# Altium schematic sheet STM32F103C8.SchDoc
size A4
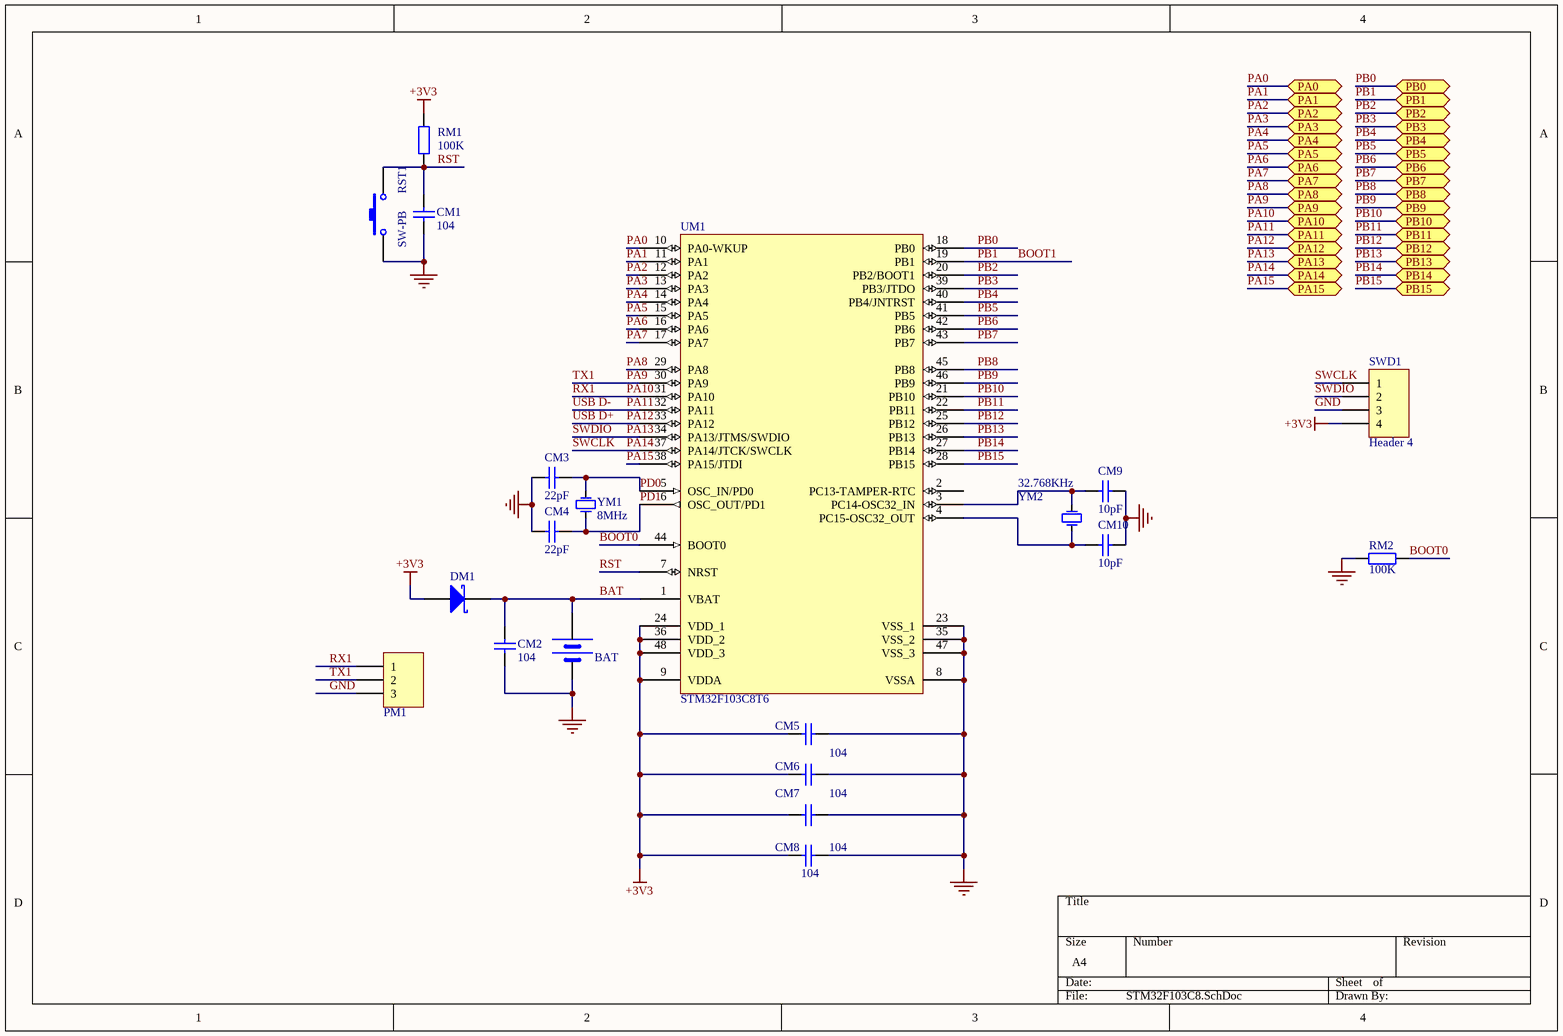
[diagram p0: STM32F103C8.SchDoc]

## Parts
BAT  BATT  [BATM]  (value not drawn)
CM1  value 104  [CAPC1608N]  (hidden comment: Cap1)
CM2  value 104  [CAPC1608N]  (hidden comment: Cap1)
CM3  value 22pF  [CAPC1608N]  (hidden comment: Cap1)
CM4  value 22pF  [CAPC1608N]  (hidden comment: Cap1)
CM5  value 104  [CAPC1608N]  (hidden comment: Cap1)
CM6  value 104  [CAPC1608N]  (hidden comment: Cap1)
CM7  value 104  [CAPC1608N]  (hidden comment: Cap1)
CM8  value 104  [CAPC1608N]  (hidden comment: Cap1)
CM9  value 10pF  [CAPC1608N]  (hidden comment: Cap1)
CM10  value 10pF  [CAPC1608N]  (hidden comment: Cap1)
DM1  D Schottky  [DO-214AC]  (value not drawn)
PM1  Header 3  [HDR1X3]  (value not drawn)
RM1  value 100K  [RESC1608N]  (hidden comment: Res1)
RM2  value 100K  [RESC1608N]  (hidden comment: Res1)
RST1  SW-PB  [SW-3x6]
SWD1  Header 4  [HDR1X4]
UM1  STM32F103C8T6  [LQFP48_L]
YM1  8MHz  [XTAL-5032]
YM2  32.768KHz  [XTAL-206 - duplicate]

## Ports
PA0, PA1, PA2, PA3, PA4, PA5, PA6, PA7, PA8, PA9, PA10, PA11, PA12, PA13, PA14, PA15, PB0, PB1, PB2, PB3, PB4, PB5, PB6, PB7, PB8, PB9, PB10, PB11, PB12, PB13, PB14, PB15

## Nets
+3V3: CM5.2 CM6.2 CM7.2 CM8.2 DM1.1(A) RM1.2 SWD1.4 UM1.9(VDDA) UM1.24(VDD_1) UM1.36(VDD_2) UM1.48(VDD_3)
GND: BAT.2(GND) CM1.1 CM2.1 CM3.1 CM4.1 CM5.1 CM6.1 CM7.1 CM8.1 CM9.1 CM10.1 PM1.3 RM2.2 RST1.1 SWD1.3 UM1.8(VSSA) UM1.23(VSS_1) UM1.35(VSS_2) UM1.47(VSS_3)
BAT: BAT.1(VCC) CM2.2 DM1.2(K) UM1.1(VBAT)
BOOT0: RM2.1 UM1.44(BOOT0)
BOOT1: UM1.19(PB1) ; port PB1  [also labelled PB1]
PA0: UM1.10(PA0-WKUP) ; port PA0
PA1: UM1.11(PA1) ; port PA1
PA2: UM1.12(PA2) ; port PA2
PA3: UM1.13(PA3) ; port PA3
PA4: UM1.14(PA4) ; port PA4
PA5: UM1.15(PA5) ; port PA5
PA6: UM1.16(PA6) ; port PA6
PA7: UM1.17(PA7) ; port PA7
PA8: UM1.29(PA8) ; port PA8
PA9: PM1.2 UM1.30(PA9) ; port PA9  [also labelled TX1]
PA10: PM1.1 UM1.31(PA10) ; port PA10  [also labelled RX1]
PA11: UM1.32(PA11) ; port PA11  [also labelled USB D-]
PA12: UM1.33(PA12) ; port PA12  [also labelled USB D+]
PA13: SWD1.2 UM1.34(PA13/JTMS/SWDIO) ; port PA13  [also labelled SWDIO]
PA14: SWD1.1 UM1.37(PA14/JTCK/SWCLK) ; port PA14  [also labelled SWCLK]
PA15: UM1.38(PA15/JTDI) ; port PA15
PB0: UM1.18(PB0) ; port PB0
PB2: UM1.20(PB2/BOOT1) ; port PB2
PB3: UM1.39(PB3/JTDO) ; port PB3
PB4: UM1.40(PB4/JNTRST) ; port PB4
PB5: UM1.41(PB5) ; port PB5
PB6: UM1.42(PB6) ; port PB6
PB7: UM1.43(PB7) ; port PB7
PB8: UM1.45(PB8) ; port PB8
PB9: UM1.46(PB9) ; port PB9
PB10: UM1.21(PB10) ; port PB10
PB11: UM1.22(PB11) ; port PB11
PB12: UM1.25(PB12) ; port PB12
PB13: UM1.26(PB13) ; port PB13
PB14: UM1.27(PB14) ; port PB14
PB15: UM1.28(PB15) ; port PB15
PD0: CM3.2 UM1.5(OSC_IN/PD0) YM1.2(OSC2)
PD1: CM4.2 UM1.6(OSC_OUT/PD1) YM1.1(OSC1)
RST: CM1.2 RM1.1 RST1.2 UM1.7(NRST)
NetCM9_2: CM9.2 UM1.3(PC14-OSC32_IN) YM2.1(OSC1)
NetCM10_2: CM10.2 UM1.4(PC15-OSC32_OUT) YM2.2(OSC2)

Not connected (* = marked no-connect by the designer): UM1 2(PC13-TAMPER-RTC)

## Library data of the parts
BAT = BAT
CM1-CM10 = Cap1: Capacitor; Published: 8-Jun-2000; LatestRevisionDate: 17-Jul-2002; LatestRevisionNote: Re-released for DXP Platform.; PackageReference: RAD-0.3; Publisher: Altium Limited
DM1 = D Schottky: Schottky Diode; Published: 8-Jun-2000; LatestRevisionDate: 17-Jul-2002; LatestRevisionNote: Re-released for DXP Platform.; PackageReference: SMB; Publisher: Altium Limited; Code_JEDEC: DO-214-AA
PM1 = Header 3: Header, 3-Pin; LatestRevisionDate: 17-Jul-2002; LatestRevisionNote: Re-released for DXP Platform.; Publisher: Altium Limited
RM1 RM2 = Res1: Resistor; Published: 8-Jun-2000; LatestRevisionDate: 17-Jul-2002; LatestRevisionNote: Re-released for DXP Platform.; PackageReference: AXIAL-0.4; Publisher: Altium Limited
RST1 = SW-PB: Switch; Published: 24-Mar-1999; LatestRevisionDate: 17-Jul-2002; LatestRevisionNote: Re-released for DXP Platform.; PackageReference: SPST-2; Publisher: Altium Limited; PackageDescription: Switch; 2 Leads
SWD1 = Header 4: Header, 4-Pin; LatestRevisionDate: 17-Jul-2002; LatestRevisionNote: Re-released for DXP Platform.; Publisher: Altium Limited
UM1 = STM32F103C8T6: STM32 ARM-based 32-bit MCU with 64 Kbytes Flash, 48-pin LQFP, Industrial Temperature; Published: 30-May-2008; DatasheetVersion: rev6, Mar-2008; PackageVersion: Mar-2008; PackageReference: LQFP48; Publisher: Altium Limited; PackageDescription: 48-Pin Low-Profile Quad Flat Pack, 7 x 7 mm Body, 0.5 mm Pitch (LQFP48); ComponentLink1Description: Manufacturer Link; ComponentLink1URL: www.st.com/stm32; ComponentLink2Description: Datasheet; ComponentLink2URL: http://www.st.com/stonline/products/literature/ds/13587.pdf
YM1 YM2 = XTAL: Crystal Oscillator; Published: 8-Jun-2000; LatestRevisionDate: 17-Jul-2002; LatestRevisionNote: Re-released for DXP Platform.; PackageReference: R38; Publisher: Altium Limited; PackageDescription: Crystal, Thru-Hole; 2 Leads; Body 3.1 x 8.2 mm (Dia.xH)